# Altium schematic sheet Connectors.SchDoc
size A4; CompanyName: Technische Hochschule Nürnberg Georg Simon Ohm; Organization: UltraZohm; Address1: Kesslerplatz 12; Address2: 90489 Nürnberg; Address3: GERMANY; SheetNumber: 2; SheetTotal: 7; Website: www.ultrazohm.com
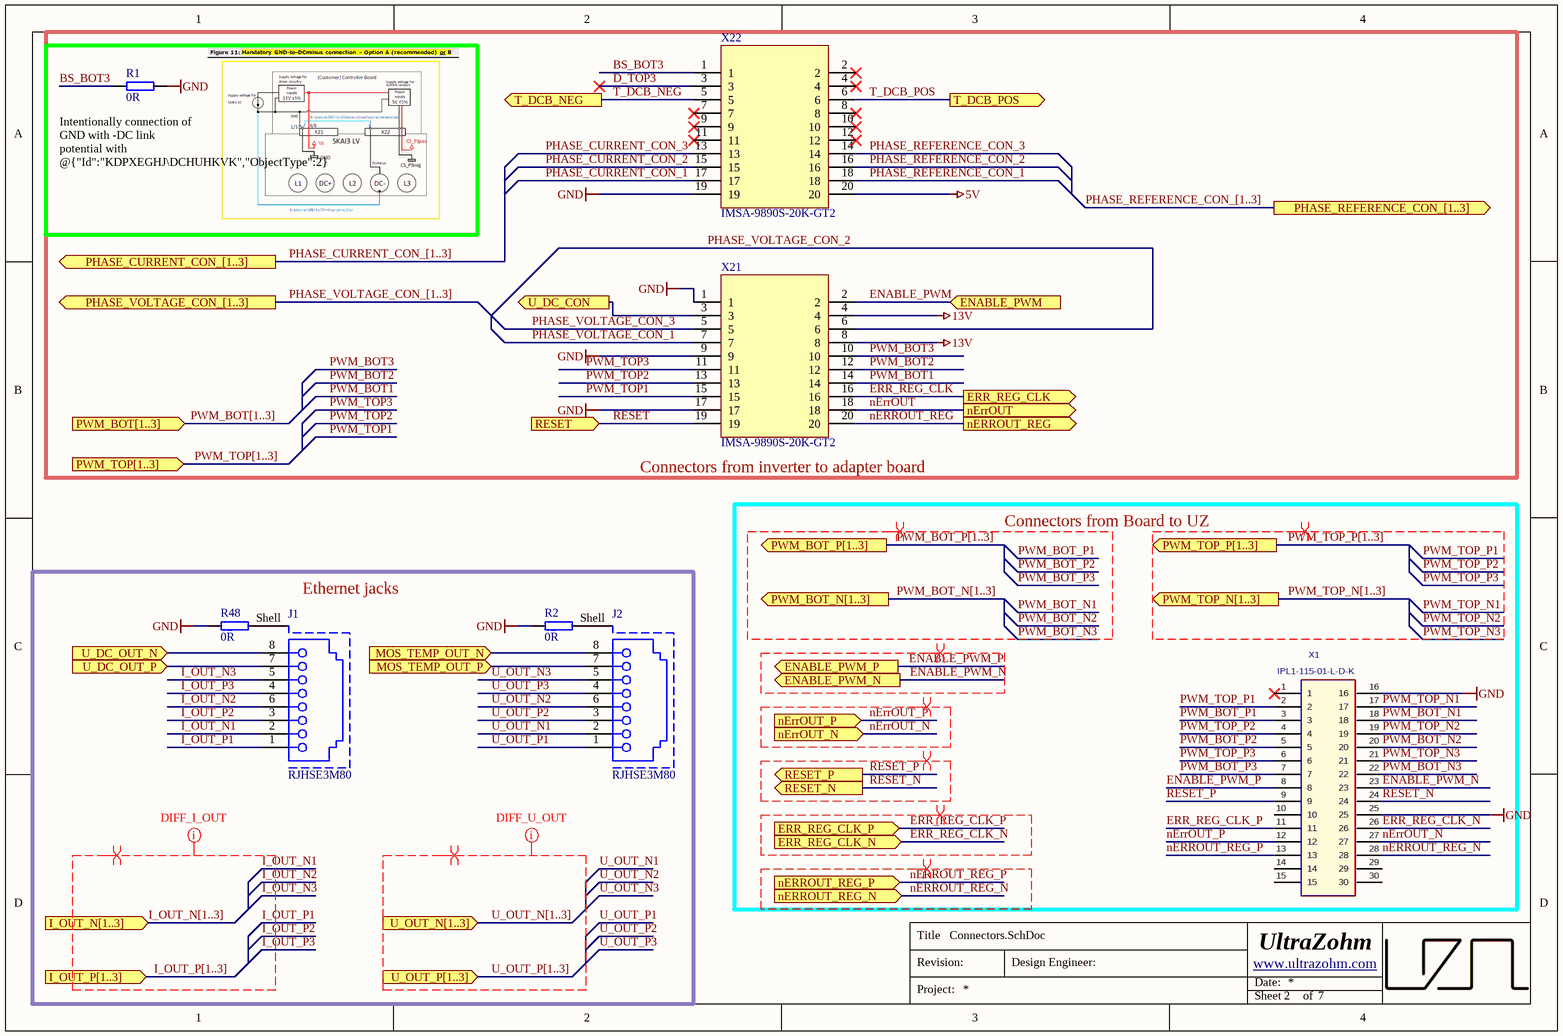
[diagram p0: Connectors.SchDoc]

## Parts
J1  RJHSE3M80  [RJHSE3M80]
J2  RJHSE3M80  [RJHSE3M80]
R1  0R  [RES 0603_1608]
R2  0R  [RES 0603_1608]
R48  0R  [RES 0603_1608]
X1  IPL1-115-01-L-D-K  [IPL1-115-01-YYY-D-K]
X21  IMSA-9890S-20K-GT2  [IMSA-9890S-20Z924]
X22  IMSA-9890S-20K-GT2  [IMSA-9890S-20Z924]

## Blocks framed on the sheet
Connectors from inverter to adapter board: R1 X21 X22
Connectors from Board to UZ: X1
Ethernet jacks: J1 J2 R2 R48

## Ports
ENABLE_PWM (in), ENABLE_PWM_N (out), ENABLE_PWM_P (out), ERR_REG_CLK (out), ERR_REG_CLK_N (in), ERR_REG_CLK_P (in), I_OUT_N[1..3] (in), I_OUT_P[1..3] (in), MOS_TEMP_OUT_N (in), MOS_TEMP_OUT_P (in), nErrOUT (out), nErrOUT_N (in), nErrOUT_P (in), nERROUT_REG (out), nERROUT_REG_N (in), nERROUT_REG_P (in), PHASE_CURRENT_CON_[1..3] (out), PHASE_REFERENCE_CON_[1..3] (out), PHASE_VOLTAGE_CON_[1..3] (out), PWM_BOT[1..3] (in), PWM_BOT_N[1..3] (out), PWM_BOT_P[1..3] (out), PWM_TOP[1..3] (in), PWM_TOP_N[1..3] (out), PWM_TOP_P[1..3] (out), RESET (in), RESET_N (out), RESET_P (out), T_DCB_NEG (out), T_DCB_POS (out), U_DC_CON (out), U_DC_OUT_N (in), U_DC_OUT_P (in), U_OUT_N[1..3] (in), U_OUT_P[1..3] (in)

## Nets
5V: X22.20
13V: X21.4 X21.8
GND: R1.2 R2.1 R48.1 X1.16 X1.25 X21.1 X21.9 X21.17 X22.19
BS_BOT3: R1.1 X22.1
D_TOP3: X22.3
ENABLE_PWM: X21.2 ; port ENABLE_PWM
ENABLE_PWM_N: X1.23 ; port ENABLE_PWM_N
ENABLE_PWM_P: X1.8 ; port ENABLE_PWM_P
ERR_REG_CLK: X21.16 ; port ERR_REG_CLK
ERR_REG_CLK_N: X1.26 ; port ERR_REG_CLK_N
ERR_REG_CLK_P: X1.11 ; port ERR_REG_CLK_P
I_OUT_N1: J1.2
I_OUT_N2: J1.6
I_OUT_N3: J1.5
I_OUT_P1: J1.1
I_OUT_P2: J1.3
I_OUT_P3: J1.4
MOS_TEMP_OUT_N: J2.8 ; port MOS_TEMP_OUT_N
MOS_TEMP_OUT_P: J2.7 ; port MOS_TEMP_OUT_P
nErrOUT: X21.18 ; port nErrOUT
nErrOUT_N: X1.27 ; port nErrOUT_N
nErrOUT_P: X1.12 ; port nErrOUT_P
nERROUT_REG: X21.20 ; port nERROUT_REG
nERROUT_REG_N: X1.28 ; port nERROUT_REG_N
nERROUT_REG_P: X1.13 ; port nERROUT_REG_P
PHASE_CURRENT_CON_1: X22.17
PHASE_CURRENT_CON_2: X22.15
PHASE_CURRENT_CON_3: X22.13
PHASE_REFERENCE_CON_1: X22.18
PHASE_REFERENCE_CON_2: X22.16
PHASE_REFERENCE_CON_3: X22.14
PHASE_VOLTAGE_CON_1: X21.7
PHASE_VOLTAGE_CON_2: X21.6
PHASE_VOLTAGE_CON_3: X21.5
PWM_BOT1: X21.14
PWM_BOT2: X21.12
PWM_BOT3: X21.10
PWM_BOT_N1: X1.18
PWM_BOT_N2: X1.20
PWM_BOT_N3: X1.22
PWM_BOT_P1: X1.3
PWM_BOT_P2: X1.5
PWM_BOT_P3: X1.7
PWM_TOP1: X21.15
PWM_TOP2: X21.13
PWM_TOP3: X21.11
PWM_TOP_N1: X1.17
PWM_TOP_N2: X1.19
PWM_TOP_N3: X1.21
PWM_TOP_P1: X1.2
PWM_TOP_P2: X1.4
PWM_TOP_P3: X1.6
RESET: X21.19 ; port RESET
RESET_N: X1.24 ; port RESET_N
RESET_P: X1.9 ; port RESET_P
T_DCB_NEG: X22.5 ; port T_DCB_NEG
T_DCB_POS: X22.6 ; port T_DCB_POS
U_DC_CON: X21.3 ; port U_DC_CON
U_DC_OUT_N: J1.8 ; port U_DC_OUT_N
U_DC_OUT_P: J1.7 ; port U_DC_OUT_P
U_OUT_N1: J2.2
U_OUT_N2: J2.6
U_OUT_N3: J2.5
U_OUT_P1: J2.1
U_OUT_P2: J2.3
U_OUT_P3: J2.4
NetJ1_Shell: J1.Shell R48.2
NetJ2_Shell: J2.Shell R2.2

Not connected (* = marked no-connect by the designer): X1 1* 10 14 15 29 30; X22 2* 4* 7* 8* 9* 10* 11* 12*

## Buses and harness runs
bus I_OUT_N[1..3] = port I_OUT_N[1..3]
bus I_OUT_P[1..3] = port I_OUT_P[1..3]
bus PHASE_CURRENT_CON_[1..3] = port PHASE_CURRENT_CON_[1..3]
bus PHASE_REFERENCE_CON_[1..3] = port PHASE_REFERENCE_CON_[1..3]
bus PHASE_VOLTAGE_CON_[1..3] = port PHASE_VOLTAGE_CON_[1..3]
bus PWM_BOT[1..3] = port PWM_BOT[1..3]
bus PWM_BOT_N[1..3] = port PWM_BOT_N[1..3]
bus PWM_BOT_P[1..3] = port PWM_BOT_P[1..3]
bus PWM_TOP[1..3] = port PWM_TOP[1..3]
bus PWM_TOP_N[1..3] = port PWM_TOP_N[1..3]
bus PWM_TOP_P[1..3] = port PWM_TOP_P[1..3]
bus U_OUT_N[1..3] = port U_OUT_N[1..3]
bus U_OUT_P[1..3] = port U_OUT_P[1..3]

## Layout directives
differential pair: ENABLE_PWM_N, ENABLE_PWM_P, ERR_REG_CLK_N, ERR_REG_CLK_P, I_OUT_N1, I_OUT_N2, I_OUT_N3, I_OUT_N[1..3], I_OUT_P1, I_OUT_P2, I_OUT_P3, I_OUT_P[1..3], nErrOUT_N, nErrOUT_P, nERROUT_REG_N, nERROUT_REG_P, PWM_BOT_N1, PWM_BOT_N2, PWM_BOT_N3, PWM_BOT_N[1..3], PWM_BOT_P1, PWM_BOT_P2, PWM_BOT_P3, PWM_BOT_P[1..3], PWM_TOP_N1, PWM_TOP_N2, PWM_TOP_N3, PWM_TOP_N[1..3], PWM_TOP_P1, PWM_TOP_P2, PWM_TOP_P3, PWM_TOP_P[1..3], RESET_N, RESET_P, U_OUT_N[1..3], U_OUT_P[1..3]
net class DIFF_I_OUT: I_OUT_N1, I_OUT_N2, I_OUT_N3, I_OUT_N[1..3], I_OUT_P1, I_OUT_P2, I_OUT_P3, I_OUT_P[1..3]
net class DIFF_U_OUT: U_OUT_N[1..3], U_OUT_P[1..3]

## Notes on the sheet
- (near R1) Intentionally connection of GND with -DC link potential with @{"Id":"KDPXEGHJ\DCHUHKVK","ObjectType":2}
- Title
- Revision:
- Design Engineer:
- Date:
- Project:
- Sheet
- of

## Library data of the parts
J1 J2 = RJHSE3M80: CAT5, RJ45 Connector, 1 port, vertical; Manufacturer: Amphenol; Created from: DHufnagel; Manufacturer Part Number: RJHSE3M80; PartID: 12; Created On: 06.06.2023 05:55:53; ComponentLink1Description: Datasheet; ComponentLink1URL: https://cdn.amphenol-cs.com/media/wysiwyg/files/documentation/datasheet/inputoutput/io-modjack-rjhse.pdf; Component Type: RJ45 Connector; Device Package: RJ45; Last Updated: 06.06.2023 05:55:53; Mounting Type: THT; Series: RJHSE; Supplier 1: Mouser; Supplier Part Number 1: 523-RJHSE3M80; Supplier 2: LCSC; Supplier Part Number 2: C3179193; Type: RJ45 Connector; Live Cycle Status: 1; LCSC Part Number: C3179193; Stock number: not stored
R1 R2 R48 = RC0603JR-070RL: SMD resistor E24 series; Manufacturer: YAGEO; Tolerance: 5%; Created from: MGremer; Manufacturer Part Number: RC0603JR-070RL; PartID: 1; Created On: 14.12.2020 16:17:14; ComponentLink1Description: Datasheet; ComponentLink1URL: https://www.mouser.de/datasheet/2/447/PYu-RC_Group_51_RoHS_L_10-1664068.pdf; Component Type: SMD resistor; Device Package: 0603; Last Updated: 04.03.2021 09:09:42; Mounting Type: SMD; Supplier 1: Mouser; Supplier Part Number 1: 603-RC0603JR-070RL; Supplier 2: LCSC; Supplier Part Number 2: C21189; Type: Resistor; Value: 0R; Live Cycle Status: 1; Stock number: Labor SMD Container; LCSC Part Number: C21189
X1 = IPL1-115-01-L-D-K: 2.54 mm Double Row Terminal Assembly; Manufacturer: SAMTEC; Created from: MGremer; Number of positions: 30; Manufacturer Part Number: IPL1-115-01-L-D-K; PartID: 28; Created On: 01.12.2020 18:14:32; ComponentLink1Description: Homepage; ComponentLink1URL: https://www.samtec.com/de/products/ipl1; Component Type: Samtec Connector; Device Package: Connector; Last Updated: 15.02.2021 10:08:03; Mounting Type: THT; Supplier 1: SAMTEC; Supplier Part Number 1: IPL1-115-01-L-D-K; Type: Connector; Live Cycle Status: 1; Number of rows: 2; Stock number: not stored
X21 X22 = IMSA-9890S-20K-GT2: Board to Board Connector; Manufacturer: IRISO; Created from: DHufnagel; Number of positions: 20; Manufacturer Part Number: IMSA-9890S-20K-GT2; PartID: 22; Created On: 26.02.2021 16:36:12; ComponentLink1Description: Homepage; ComponentLink1URL: https://www.irisoele.com/cn/products/view/IMSA-9890S-20Z924/; Component Type: Board to Board Connector; Device Package: THT; Last Updated: 26.02.2021 16:37:20; Mounting Type: THT; Series: 9890S; Supplier 1: IRISO; Supplier Part Number 1: IMSA-9890S-20Z924; Type: Board to Board Connector; Live Cycle Status: 1; Stock number: not stored; Number of rows: 2